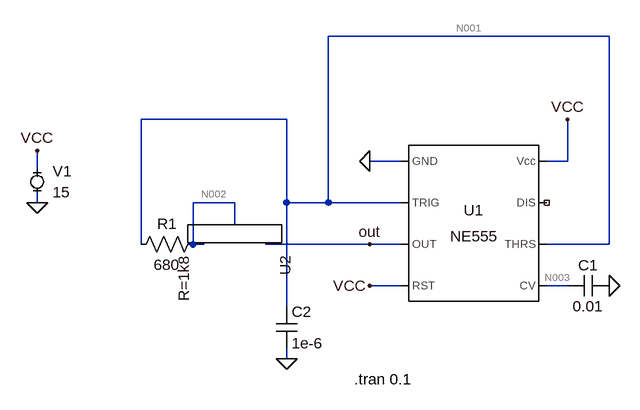
[diagram p0: schematic ne555.asc]
ne555.asc, the LTspice schematic file:
Version 4
SHEET 1 880 680
WIRE 416 -112 -16 -112
WIRE -80 16 -304 16
WIRE 96 80 48 80
WIRE 352 80 352 16
WIRE 352 80 320 80
WIRE -464 96 -464 64
WIRE -464 144 -464 128
WIRE -160 144 -224 144
WIRE -80 144 -80 16
WIRE -16 144 -16 -112
WIRE -16 144 -80 144
WIRE 96 144 -16 144
WIRE -160 176 -160 144
WIRE -304 208 -304 16
WIRE -224 208 -224 144
WIRE -208 208 -224 208
WIRE 48 208 -112 208
WIRE 96 208 48 208
WIRE 416 208 416 -112
WIRE 416 208 320 208
WIRE 96 272 48 272
WIRE 352 272 320 272
WIRE -80 304 -80 144
WIRE -80 384 -80 368
FLAG 48 80 0
FLAG -464 144 0
FLAG -464 64 VCC
FLAG 416 272 0
FLAG 48 272 VCC
FLAG -80 384 0
FLAG 48 208 out
FLAG 352 16 VCC
SYMBOL Misc\\NE555 208 176 R0
SYMATTR InstName U1
SYMBOL MiniSyms4\\voltage- -464 112 R0
SYMATTR InstName V1
SYMATTR Value 15
SYMBOL cap 416 256 R90
WINDOW 0 0 32 VBottom 2
WINDOW 3 32 32 VTop 2
SYMATTR InstName C1
SYMATTR Value 0.01
SYMBOL cap -96 304 R0
SYMATTR InstName C2
SYMATTR Value 1e-6
SYMBOL res -208 192 R90
WINDOW 0 0 56 VBottom 2
WINDOW 3 32 56 VTop 2
SYMATTR InstName R1
SYMATTR Value 680
SYMBOL EXTRA\\Misc\\pot -160 208 R90
SYMATTR InstName U2
SYMATTR Value R=1k8
SYMATTR Value2 T=.9
TEXT 24 416 Left 2 !.tran 0.1

The netlist it stands for:
* ne555.asc
XU1 0 N001 out VCC N003 N001 NC_01 VCC NE555  ; pins GND TRIG OUT RST CV THRS DIS Vcc
V1 VCC 0 15
C1 0 N003 0.01
C2 N001 0 1e-6
R1 N002 N001 680
XU2 out N002 N002 R=1k8 T=.9
.tran 0.1
.lib NE555.sub
.lib POT.lib
.backanno
.end

* Results of the author's LTspice run, read from the files saved beside the schematic
* Operating Point, zero values left out:
*   V(n001) = 15 V
*   V(n003) = 10 V
*   V(vcc) = 15 V
*   V(out) = 15 V
*   V(n002) = 15 V
*   I(R1) = 30 nA
*   I(V1) = -4.854 mA
*   Ix(u1:1) = -4.854 mA
*   Ix(u1:2) = 15 nA
*   Ix(u1:3) = -30 nA
*   Ix(u1:4) = 89.33 µA
*   Ix(u1:6) = 15 nA
*   Ix(u1:8) = 4.765 mA
*   Ix(u2:1) = 30 nA
*   Ix(u2:3) = -30 nA
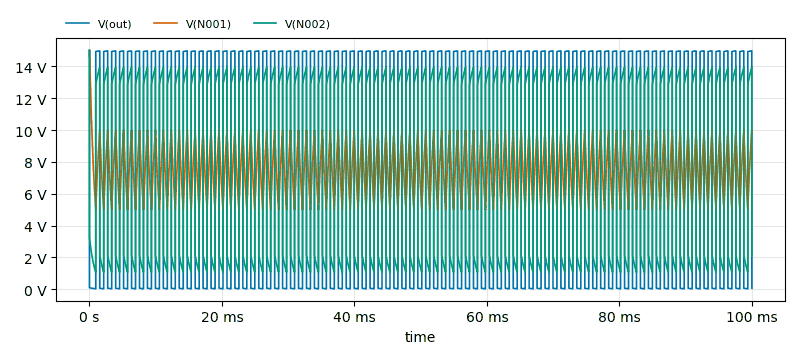
[diagram p1: Transient Analysis of ne555.asc, plotted from the saved traces]
* Transient Analysis, 1 run:
*   V(out): min 34.72 mV, max 15 V, average 7.473 V, rms 10.55 V, last 68.18 mV
*   V(N001): min 4.999 V, max 15 V, average 7.518 V, rms 7.702 V, last 9.828 V
*   V(N002): min 1.074 V, max 15 V, average 7.482 V, rms 9.558 V, last 2.111 V